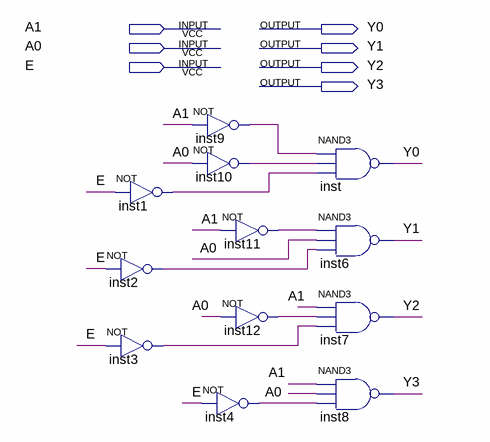
[diagram p0: schematic sheet]
// Quartus schematic lab3pt2.bdf as structural Verilog: 12 symbols, 7 pins
module lab3pt2 (
  input  A1,
  input  A0,
  input  E,
  output Y0,
  output Y1,
  output Y2,
  output Y3
);

  wire inst1_out, inst2_out, inst3_out, inst4_out, inst9_out, inst10_out, inst11_out, inst12_out;

  not inst1 (inst1_out, E);
  not inst2 (inst2_out, E);
  not inst3 (inst3_out, E);
  not inst9 (inst9_out, A1);
  not inst10 (inst10_out, A0);
  not inst11 (inst11_out, A1);
  not inst12 (inst12_out, A0);
  not inst4 (inst4_out, E);
  nand inst (Y0, inst9_out, inst10_out, inst1_out);
  nand inst6 (Y1, inst11_out, A0, inst2_out);
  nand inst7 (Y2, A1, inst12_out, inst3_out);
  nand inst8 (Y3, A1, A0, inst4_out);
endmodule
